# EAGLE schematic analog_sensor_single_channel_R1 (EAGLE 7.6.0)
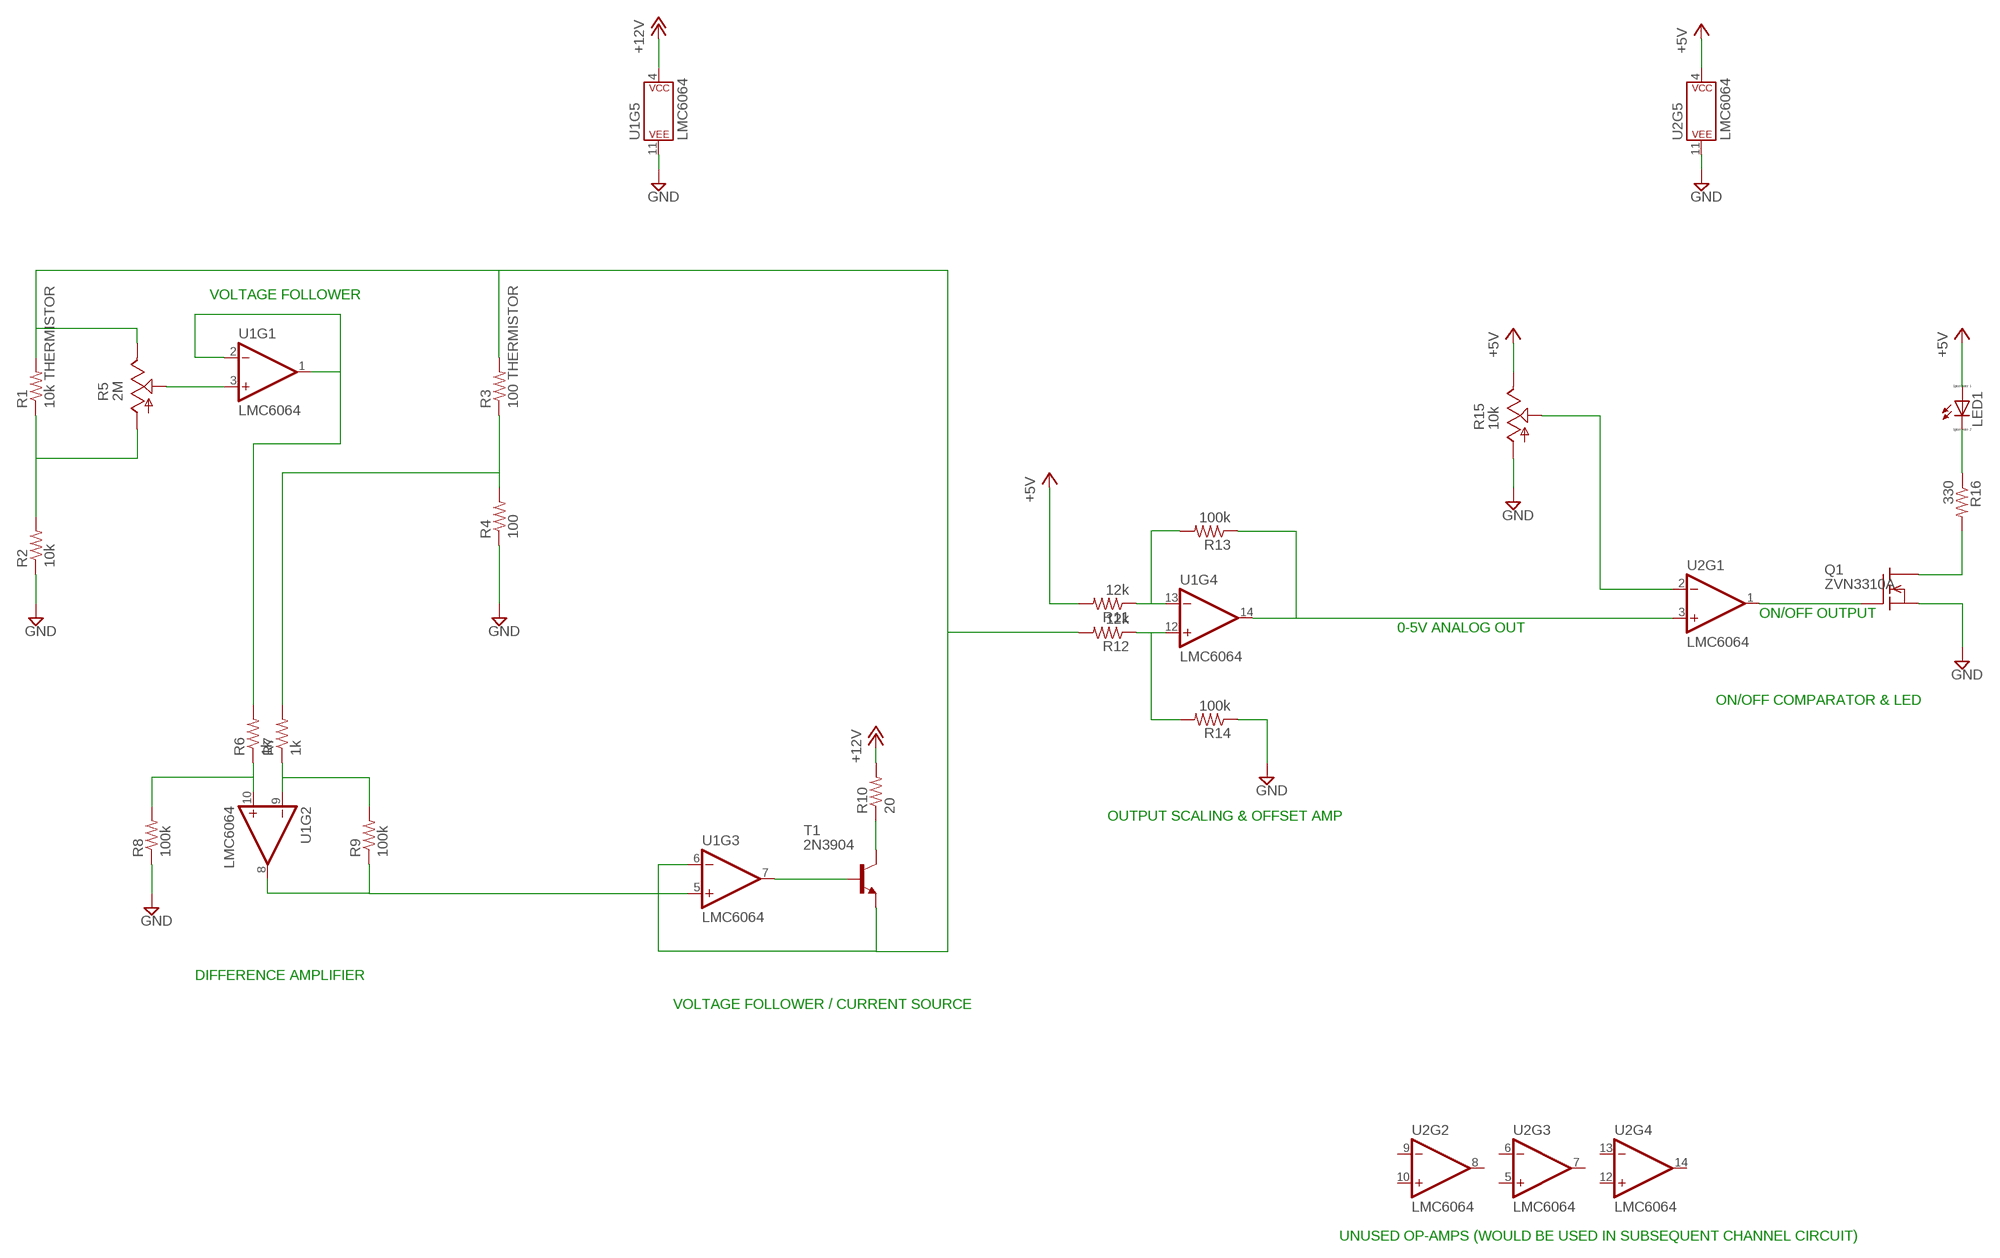
[diagram p0: schematic, sheet 1]

## Parts
LED1  LED_E  [LED_1206]
Q1  ZVN3310A  [TO92]
R1  10k THERMISTOR  R-US_R0603  [R0603]
R2  10k  R-US_R0603  [R0603]
R3  100 THERMISTOR  R-US_R0603  [R0603]
R4  100  R-US_R0603  [R0603]
R5  2M  TRIM_US-SM-42/43W  [SM-42/43W]
R6  1k  R-US_R0603  [R0603]
R7  1k  R-US_R0603  [R0603]
R8  100k  R-US_R0603  [R0603]
R9  100k  R-US_R0603  [R0603]
R10  20  R-US_R0603  [R0603]
R11  12k  R-US_R0603  [R0603]
R12  12k  R-US_R0603  [R0603]
R13  100k  R-US_R0603  [R0603]
R14  100k  R-US_R0603  [R0603]
R15  10k  TRIM_US-SM-42/43W  [SM-42/43W]
R16  330  R-US_R0603  [R0603]
T1  2N3904  [TO92]
U1  LMC6064  [SO14]
U2  LMC6064  [SO14]

## Nets
+5V: LED1.A R11.2 R15.3(E) U2.4(P$V+)
+12V: R10.2 U1.4(P$V+)
GND: Q1.3(S) R2.1 R4.1 R8.1 R14.1 R15.1(A) U1.11(P$V-) U2.11(P$V-)
N$1: R5.2(S) U1.3(+IN)
N$2: Q1.1(G) U2.1(OUT)
N$3: R1.1 R2.2 R5.1(A)
N$4: T1.2(B) U1.7(OUT)
N$5: R6.2 U1.1(OUT) U1.2(-IN)
N$6: R6.1 R8.2 U1.10(+IN)
N$7: R7.1 R9.2 U1.9(-IN)
N$8: R9.1 U1.5(+IN) U1.8(OUT)
N$9: R3.1 R4.2 R7.2
N$10: R1.2 R3.2 R5.3(E) R12.2 T1.3(E) U1.6(-IN)
N$11: R10.1 T1.1(C)
N$12: R12.1 R14.2 U1.12(+IN)
N$13: R11.1 R13.2 U1.13(-IN)
N$14: R15.2(S) U2.2(-IN)
N$15: R13.1 U1.14(OUT) U2.3(+IN)
N$16: Q1.2(D) R16.2
N$17: LED1.C R16.1
Unconnected: U2.5(+IN) U2.6(-IN) U2.7(OUT) U2.8(OUT) U2.9(-IN) U2.10(+IN) U2.12(+IN) U2.13(-IN) U2.14(OUT)

## Notes on the sheet
- VOLTAGE FOLLOWER
- ON/OFF OUTPUT
- 0-5V ANALOG OUT
- ON/OFF COMPARATOR & LED
- OUTPUT SCALING & OFFSET AMP
- DIFFERENCE AMPLIFIER
- VOLTAGE FOLLOWER / CURRENT SOURCE
- UNUSED OP-AMPS (WOULD BE USED IN SUBSEQUENT CHANNEL CIRCUIT)

## Library data of the parts
LED1 = eagle-ltspice:LED_E: LED Source: http://www.osram.convergy.de Source: www.luxeon.com Source: www.kingbright.com; SPICEMODEL: NONE; SPICEPREFIX: D; SPICETYPE: diode
Q1 = transistor-fet:ZVN3310A: N-Channel Enhancement MOSFET not checked
R1-R4 R6-R14 R16 = resistor:R-US_: RESISTOR, American symbol
R5 R15 = pot:TRIM_US-: POTENTIOMETER
T1 = transistor:2N3904: NPN TRANSISTOR
U1 U2 = SparkFun-IC-Amplifiers:LMC6064: IC LMV324 Quad Op Amp Jellybean quad op-amp Datasheet <http://cdn.sparkfun.com/datasheets/Sensors/Sound/LMV324.pdf> SparkFun Products SparkFun Sensor Kit <https://www.sparkfun.com/products/13754> (DEV-13754) SparkFun Inventor's Kit for Arduino 101 <https://www.sparkfun.com/products/13844> (KIT-13844) SparkFun Sound Detector <https://www.sparkfun.com/products/12642> (SEN-12642); PROD_ID: LMC6064